# Altium schematic sheet 160901137.SchDoc
size A4
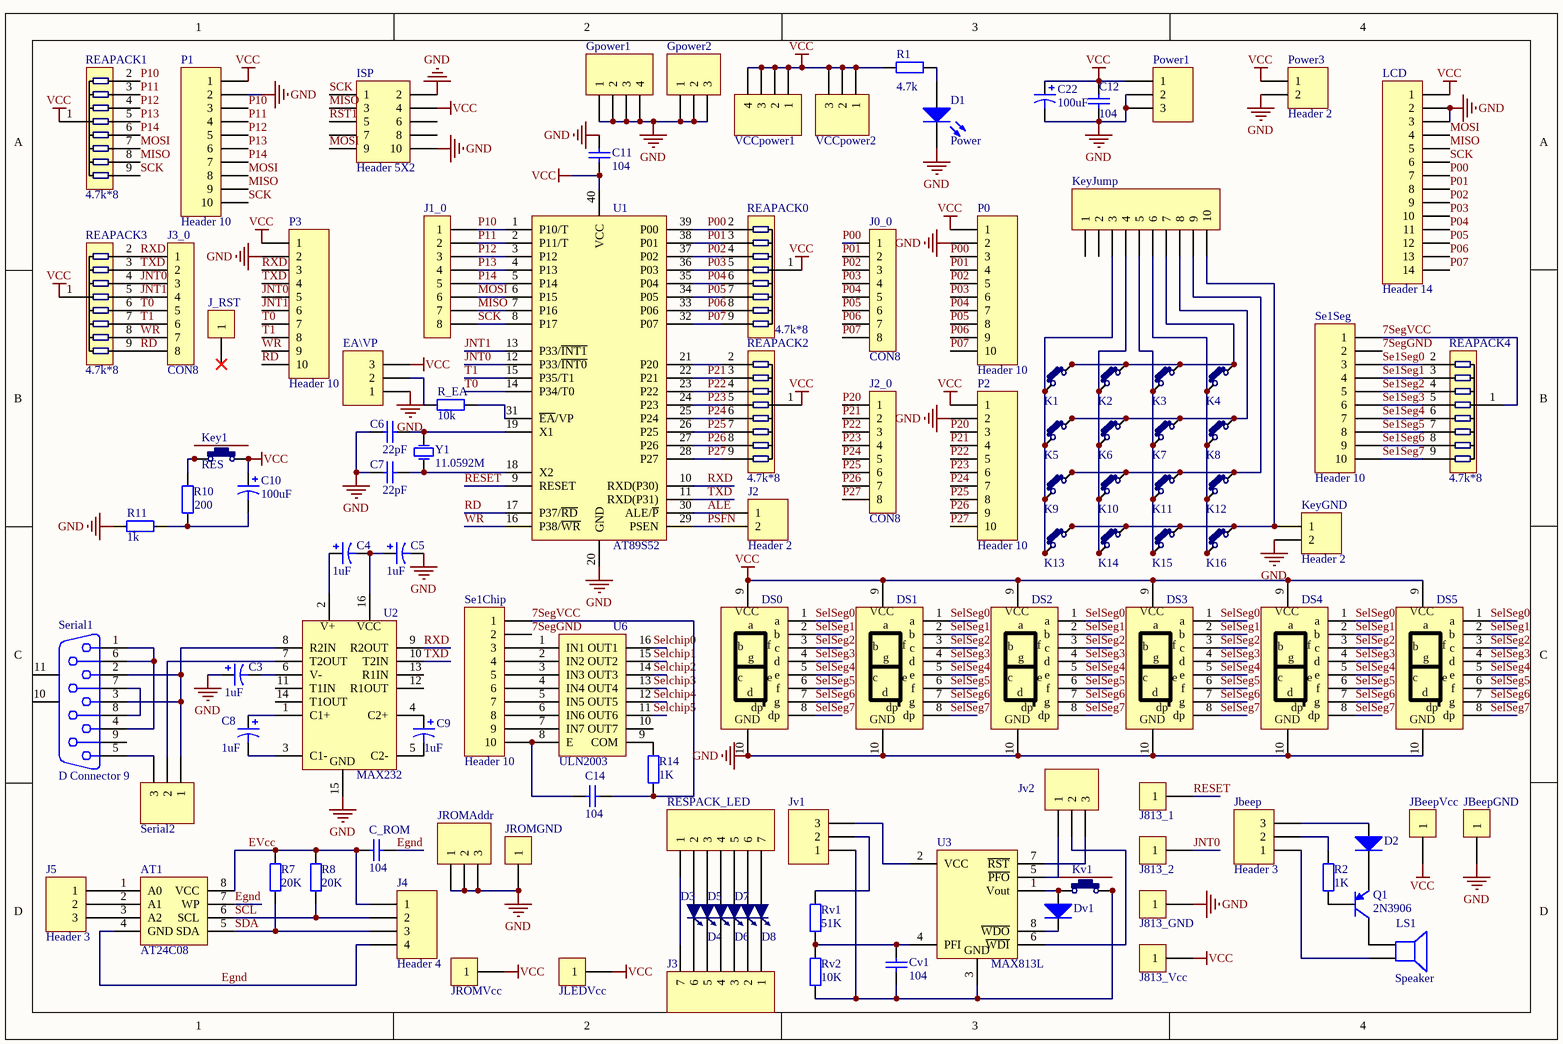
[diagram p0: 160901137.SchDoc]

## Parts
AT1  AT24C08  [DIP-8]
C3  value 1uF  [RB0.1-0.2]  (hidden comment: Cap Pol1)
C4  value 1uF  [RB0.1-0.2]  (hidden comment: Cap Pol1)
C5  value 1uF  [RB0.1-0.2]  (hidden comment: Cap Pol1)
C6  value 22pF  [RAD-0.1]  (hidden comment: Cap)
C7  value 22pF  [RAD-0.1]  (hidden comment: Cap)
C8  value 1uF  [RB0.1-0.2]  (hidden comment: Cap Pol1)
C9  value 1uF  [RB0.1-0.2]  (hidden comment: Cap Pol1)
C10  value 100uF  [RB0.1-0.2]  (hidden comment: Cap Pol1)
C11  value 104  [RAD-0.1]  (hidden comment: Cap)
C12  104  [RAD-0.1]
C14  104  [RAD-0.1]
C22  value 100uF  [RB0.1-0.2]  (hidden comment: Cap Pol1)
C_ROM  value 104  [RAD-0.1]  (hidden comment: Cap)
Cv1  104  [RAD-0.1]
D1  Power  [RB0.1-0.2]
D2  Diode 1N4148  [DO-35]  (value not drawn)
D3  LED-mini  [RB0.1-0.2]  (value not drawn)
D4  LED-mini  [RB0.1-0.2]  (value not drawn)
D5  LED-mini  [RB0.1-0.2]  (value not drawn)
D6  LED-mini  [RB0.1-0.2]  (value not drawn)
D7  LED-mini  [RB0.1-0.2]  (value not drawn)
D8  LED-mini  [RB0.1-0.2]  (value not drawn)
DS0  Display  [DISPLAY]  (value not drawn)
DS1  Display  [DISPLAY]  (value not drawn)
DS2  Display  [DISPLAY]  (value not drawn)
DS3  Display  [DISPLAY]  (value not drawn)
DS4  Display  [DISPLAY]  (value not drawn)
DS5  Display  [DISPLAY]  (value not drawn)
Dv1  Diode 1N4148  [DO-35]  (value not drawn)
EA\VP  Header 3  [HDR1X3]  (value not drawn)
Gpower1  Header 4  [HDR1X4]  (value not drawn)
Gpower2  Header 3  [HDR1X3]  (value not drawn)
ISP  Header 5X2  [HDR2X5]
J0_0  CON8  [HDR1X8]
J1_0  CON8  [HDR1X8]  (value not drawn)
J2  Header 2  [HDR1X2]
J2_0  CON8  [HDR1X8]
J3  Header 7  [HDR1X7]  (value not drawn)
J3_0  CON8  [HDR1X8]
J4  Header 4  [HDR1X4]
J5  Header 3  [HDR1X3]
J813_1  CON1  [PIN1]  (value not drawn)
J813_2  CON1  [PIN1]  (value not drawn)
J813_GND  CON1  [PIN1]  (value not drawn)
J813_Vcc  CON1  [PIN1]  (value not drawn)
J_RST  RST1  [PIN1]  (value not drawn)
Jbeep  Header 3  [HDR1X3]
JBeepGND  CON1  [PIN1]  (value not drawn)
JBeepVcc  CON1  [PIN1]  (value not drawn)
JLEDVcc  CON1  [PIN1]  (value not drawn)
JROMAddr  Header 3  [HDR1X3]  (value not drawn)
JROMGND  J_RST  [PIN1]  (value not drawn)
JROMVcc  CON1  [PIN1]  (value not drawn)
Jv1  Header 3  [HDR1X3]  (value not drawn)
Jv2  Header 3  [HDR1X3]  (value not drawn)
K1  KEY-S  [KEY]  (value not drawn)
K2  KEY-S  [KEY]  (value not drawn)
K3  KEY-S  [KEY]  (value not drawn)
K4  KEY-S  [KEY]  (value not drawn)
K5  KEY-S  [KEY]  (value not drawn)
K6  KEY-S  [KEY]  (value not drawn)
K7  KEY-S  [KEY]  (value not drawn)
K8  KEY-S  [KEY]  (value not drawn)
K9  KEY-S  [KEY]  (value not drawn)
K10  KEY-S  [KEY]  (value not drawn)
K11  KEY-S  [KEY]  (value not drawn)
K12  KEY-S  [KEY]  (value not drawn)
K13  KEY-S  [KEY]  (value not drawn)
K14  KEY-S  [KEY]  (value not drawn)
K15  KEY-S  [KEY]  (value not drawn)
K16  KEY-S  [KEY]  (value not drawn)
Key1  RES  [KEY]
KeyGND  Header 2  [HDR1X2]
KeyJump  Header 10  [HDR1X10]  (value not drawn)
Kv1  HEY-H  [KEY]  (value not drawn)
LCD  Header 14  [HDR1X14]
LS1  Speaker  [PIN2]
P0  Header 10  [HDR1X10]
P1  Header 10  [HDR1X10]
P2  Header 10  [HDR1X10]
P3  Header 10  [HDR1X10]
Power1  Header 3  [HDR1X3]  (value not drawn)
Power3  Header 2  [HDR1X2]
Q1  2N3906  [TO-92A]
R1  value 4.7k  [AXIAL-0.3]  (hidden comment: Res2)
R2  value 1K  [AXIAL-0.3]  (hidden comment: Res2)
R7  value 20K  [AXIAL-0.3]  (hidden comment: Res2)
R8  value 20K  [AXIAL-0.3]  (hidden comment: Res2)
R10  200  [AXIAL-0.3]
R11  value 1k  [AXIAL-0.3]  (hidden comment: Res2)
R14  value 1K  [AXIAL-0.3]  (hidden comment: Res2)
R_EA  value 10k  [AXIAL-0.3]  (hidden comment: Res2)
REAPACK0  4.7k*8  [HDR1X9]
REAPACK1  4.7k*8  [HDR1X9]
REAPACK2  4.7k*8  [HDR1X9]
REAPACK3  4.7k*8  [HDR1X9]
REAPACK4  4.7k*8  [HDR1X9]
RESPACK_LED  Header 7  [HDR1X7]  (value not drawn)
Rv1  value 51K  [AXIAL-0.3]  (hidden comment: Res2)
Rv2  value 10K  [AXIAL-0.3]  (hidden comment: Res2)
Se1Chip  Header 10  [HDR1X10]
Se1Seg  Header 10  [HDR1X10]
Serial1  D Connector 9  [DSUB1.385-2H9]
Serial2  Header 3  [HDR1X3]  (value not drawn)
U1  AT89S52  [DIP-40]
U2  MAX232  [DIP-16]
U3  MAX813L  [DIP-8]
U6  ULN2003  [DIP-16]
VCCpower1  Header 4  [HDR1X4]  (value not drawn)
VCCpower2  Header 3  [HDR1X3]  (value not drawn)
Y1  11.0592M  [R38]

## Nets
GND: C3.1 C5.2 C6.1 C7.1 C11.2 C12.2 C22.2 D1.2(K) DS0.10(GND) DS1.10(GND) DS2.10(GND) DS3.10(GND) DS4.10(GND) DS5.10(GND) EA\VP.1 Gpower1.1 Gpower1.2 Gpower1.3 Gpower1.4 Gpower2.1 Gpower2.2 Gpower2.3 ISP.2 ISP.10 J813_GND.1 JBeepGND.1 JROMAddr.1 JROMAddr.2 JROMAddr.3 JROMGND.1 KeyGND.2 LCD.2 LCD.3 P0.2 P1.2 P2.2 P3.2 Power1.2 Power1.3 Power3.2 R11.1 U1.20(GND) U2.15(GND)
VCC: C10.1 C11.1 C12.1 C22.1 DS0.9(VCC) DS1.9(VCC) DS2.9(VCC) DS3.9(VCC) DS4.9(VCC) DS5.9(VCC) EA\VP.3 ISP.4 J813_Vcc.1 JBeepVcc.1 JLEDVcc.1 JROMVcc.1 Key1.2 Key1.4 LCD.1 P0.1 P1.1 P2.1 P3.1 Power1.1 Power3.1 R1.1 REAPACK0.1 REAPACK1.1 REAPACK2.1 REAPACK3.1 U1.40(VCC) VCCpower1.1 VCCpower1.2 VCCpower1.3 VCCpower1.4 VCCpower2.1 VCCpower2.2 VCCpower2.3
7SegGND: Se1Chip.2 Se1Seg.2
7SegVCC: C14.1 R14.1 REAPACK4.1 Se1Chip.1 Se1Seg.1
ALE: J2.1 U1.30(ALE/~{P})
Egnd: AT1.4(GND) AT1.7(WP) C_ROM.2 J4.4
EVcc: AT1.8(VCC) C_ROM.1 J4.1 R7.2 R8.2
JNT0: J3_0.3 J813_2.1 P3.5 REAPACK3.4 U1.12(P33/~{INT0})
JNT1: J3_0.4 P3.6 REAPACK3.5 U1.13(P33/~{INT1})
MISO: ISP.3 J1_0.7 LCD.5 P1.9 REAPACK1.8 U1.7(P16)
MOSI: ISP.9 J1_0.6 LCD.4 P1.8 REAPACK1.7 U1.6(P15)
P00: J0_0.1 LCD.7 P0.3 REAPACK0.2 U1.39(P00)
P01: J0_0.2 LCD.8 P0.4 REAPACK0.3 U1.38(P01)
P02: J0_0.3 LCD.9 P0.5 REAPACK0.4 U1.37(P02)
P03: J0_0.4 LCD.10 P0.6 REAPACK0.5 U1.36(P03)
P04: J0_0.5 LCD.11 P0.7 REAPACK0.6 U1.35(P04)
P05: J0_0.6 LCD.12 P0.8 REAPACK0.7 U1.34(P05)
P06: J0_0.7 LCD.13 P0.9 REAPACK0.8 U1.33(P06)
P07: J0_0.8 LCD.14 P0.10 REAPACK0.9 U1.32(P07)
P10: J1_0.1 P1.3 REAPACK1.2 U1.1(P10/T)
P11: J1_0.2 P1.4 REAPACK1.3 U1.2(P11/T)
P12: J1_0.3 P1.5 REAPACK1.4 U1.3(P12)
P13: J1_0.4 P1.6 REAPACK1.5 U1.4(P13)
P14: J1_0.5 P1.7 REAPACK1.6 U1.5(P14)
P20: J2_0.1 P2.3
P21: J2_0.2 P2.4 REAPACK2.3 U1.22(P21)
P22: J2_0.3 P2.5 REAPACK2.4 U1.23(P22)
P23: J2_0.4 P2.6 REAPACK2.5 U1.24(P23)
P24: J2_0.5 P2.7 REAPACK2.6 U1.25(P24)
P25: J2_0.6 P2.8 REAPACK2.7 U1.26(P25)
P26: J2_0.7 P2.9 REAPACK2.8 U1.27(P26)
P27: J2_0.8 P2.10 REAPACK2.9 U1.28(P27)
PSFN: J2.2 U1.29(PSEN)
RD: J3_0.8 P3.10 REAPACK3.9 U1.17(P37/~{RD})
RESET: J813_1.1 U1.9(RESET)
RST1: ISP.5
RXD: J3_0.1 P3.3 REAPACK3.2 U1.10(RXD(P30)) U2.9(R2OUT)
SCK: ISP.1 J1_0.8 LCD.6 P1.10 REAPACK1.9 U1.8(P17)
SCL: AT1.6(SCL) J4.2 R8.1
SDA: AT1.5(SDA) J4.3 R7.1
Se1Seg0: REAPACK4.2 Se1Seg.3
Se1Seg1: REAPACK4.3 Se1Seg.4
Se1Seg2: REAPACK4.4 Se1Seg.5
Se1Seg3: REAPACK4.5 Se1Seg.6
Se1Seg4: REAPACK4.6 Se1Seg.7
Se1Seg5: REAPACK4.7 Se1Seg.8
Se1Seg6: REAPACK4.8 Se1Seg.9
Se1Seg7: REAPACK4.9 Se1Seg.10
Selchip0: U6.16(OUT1)
Selchip1: U6.15(OUT2)
Selchip2: U6.14(OUT3)
Selchip3: U6.13(OUT4)
Selchip4: U6.12(OUT5)
Selchip5: U6.11(OUT6)
SelSeg0: DS0.1(a) DS1.1(a) DS2.1(a) DS3.1(a) DS4.1(a) DS5.1(a)
SelSeg1: DS0.2(b) DS1.2(b) DS2.2(b) DS3.2(b) DS4.2(b) DS5.2(b)
SelSeg2: DS0.3(c) DS1.3(c) DS2.3(c) DS3.3(c) DS4.3(c) DS5.3(c)
SelSeg3: DS0.4(d) DS1.4(d) DS2.4(d) DS3.4(d) DS4.4(d) DS5.4(d)
SelSeg4: DS0.5(e) DS1.5(e) DS2.5(e) DS3.5(e) DS4.5(e) DS5.5(e)
SelSeg5: DS0.6(f) DS1.6(f) DS2.6(f) DS3.6(f) DS4.6(f) DS5.6(f)
SelSeg6: DS0.7(g) DS1.7(g) DS2.7(g) DS3.7(g) DS4.7(g) DS5.7(g)
SelSeg7: DS0.8(dp) DS1.8(dp) DS2.8(dp) DS3.8(dp) DS4.8(dp) DS5.8(dp)
T0: J3_0.5 P3.7 REAPACK3.6 U1.14(P34/T0)
T1: J3_0.6 P3.8 REAPACK3.7 U1.15(P35/T1)
TXD: J3_0.2 P3.4 REAPACK3.3 U1.11(RXD(P31)) U2.10(T2IN)
WR: J3_0.7 P3.9 REAPACK3.8 U1.16(P38/~{WR})
NetAT1_1: AT1.1(A0) J5.1
NetAT1_2: AT1.2(A1) J5.2
NetAT1_3: AT1.3(A2) J5.3
NetC3_2: C3.2 U2.6(V-)
NetC4_1: C4.1 U2.2(V+)
NetC4_2: C4.2 C5.1 U2.16(VCC)
NetC6_2: C6.2 U1.19(X1) Y1.2(OSC2)
NetC7_2: C7.2 U1.18(X2) Y1.1(OSC1)
NetC8_1: C8.1 U2.1(C1+)
NetC8_2: C8.2 U2.3(C1-)
NetC9_1: C9.1 U2.4(C2+)
NetC9_2: C9.2 U2.5(C2-)
NetC10_2: C10.2 R10.1 R11.2
NetC14_2: C14.2 Se1Chip.10 U6.8(E)
NetCv1_1: Cv1.1 Rv1.1 Rv2.2 U3.4(PFI)
NetCv1_2: Cv1.2 Jv1.1 Kv1.2 Kv1.4 Rv2.1 U3.3(GND)
NetD1_1: D1.1(A) R1.2
NetD2_1: D2.1(A) Jbeep.3
NetD2_2: D2.2(K) Q1.1(E)
NetD3_1: D3.1(A) RESPACK_LED.2
NetD3_2: D3.2(K) J3.6
NetD4_1: D4.1(A) RESPACK_LED.3
NetD4_2: D4.2(K) J3.5
NetD5_1: D5.1(A) RESPACK_LED.4
NetD5_2: D5.2(K) J3.4
NetD6_1: D6.1(A) RESPACK_LED.5
NetD6_2: D6.2(K) J3.3
NetD7_1: D7.1(A) RESPACK_LED.6
NetD7_2: D7.2(K) J3.2
NetD8_1: D8.1(A) RESPACK_LED.7
NetD8_2: D8.2(K) J3.1
NetDv1_1: Dv1.1(A) Kv1.1 Kv1.3 U3.1(Vout)
NetDv1_2: Dv1.2(K) U3.8(~{WDO})
NetE~{A}VP_2: EA\VP.2 R_EA.1
NetJ3_7: J3.7 RESPACK_LED.1
NetJbeep_1: Jbeep.1 LS1.2
NetJbeep_2: Jbeep.2 R2.2
NetJv1_2: Jv1.2 Rv1.2
NetJv1_3: Jv1.3 U3.2(VCC)
NetJv2_1: Jv2.1 U3.5(~{PFO})
NetJv2_2: Jv2.2 U3.6(~{WDI})
NetJv2_3: Jv2.3 U3.7(~{RST})
NetK1_1: K1.1 K1.3 K5.1 K5.3 K9.1 K9.3 K13.1 K13.3 KeyJump.3
NetK1_2: K1.2 K1.4 K2.2 K2.4 K3.2 K3.4 K4.2 K4.4 KeyJump.7
NetK2_1: K2.1 K2.3 K6.1 K6.3 K10.1 K10.3 K14.1 K14.3 KeyJump.4
NetK3_1: K3.1 K3.3 K7.1 K7.3 K11.1 K11.3 K15.1 K15.3 KeyJump.5
NetK4_1: K4.1 K4.3 K8.1 K8.3 K12.1 K12.3 K16.1 K16.3 KeyJump.6
NetK5_2: K5.2 K5.4 K6.2 K6.4 K7.2 K7.4 K8.2 K8.4 KeyJump.8
NetK9_2: K9.2 K9.4 K10.2 K10.4 K11.2 K11.4 K12.2 K12.4 KeyJump.9
NetK13_2: K13.2 K13.4 K14.2 K14.4 K15.2 K15.4 K16.2 K16.4 KeyGND.1 KeyJump.10
NetKey1_1: Key1.1 Key1.3 R10.2
NetLS1_1: LS1.1 Q1.3(C)
NetQ1_2: Q1.2(B) R2.1
NetR14_2: R14.2 U6.9(COM)
NetR_EA_2: R_EA.2 U1.31(~{EA}/VP)
NetREAPACK2_2: REAPACK2.2 U1.21(P20)
NetSe1Chip_3: Se1Chip.3 U6.1(IN1)
NetSe1Chip_4: Se1Chip.4 U6.2(IN2)
NetSe1Chip_5: Se1Chip.5 U6.3(IN3)
NetSe1Chip_6: Se1Chip.6 U6.4(IN4)
NetSe1Chip_7: Se1Chip.7 U6.5(IN5)
NetSe1Chip_8: Se1Chip.8 U6.6(IN6)
NetSe1Chip_9: Se1Chip.9 U6.7(IN7)
NetSerial1_1: Serial1.1 Serial1.4 Serial1.6
NetSerial1_2: Serial1.2 Serial1.3 Serial2.1 U2.8(R2IN)
NetSerial1_5: Serial1.5 Serial2.3
NetSerial1_7: Serial1.7 Serial1.8
NetSerial2_2: Serial2.2 U2.7(T2OUT)

Not connected (* = marked no-connect by the designer): ISP 6 7 8; J_RST 1*; KeyJump 1 2; Serial1 9 10(MH1) 11(MH2); U2 11(T1IN) 12(R1OUT) 13(R1IN) 14(T1OUT); U6 10(OUT7)

## Library data of the parts
C3-C5 C8-C10 C22 = Cap Pol1: Polarized Capacitor (Radial); Published: 8-Jun-2000; LatestRevisionDate: 17-Jul-2002; LatestRevisionNote: Re-released for DXP Platform.; PackageReference: RB7.6-15; Publisher: Altium Limited
C6 C7 C11 C_ROM = Cap: Capacitor; Published: 8-Jun-2000; LatestRevisionDate: 17-Jul-2002; LatestRevisionNote: Re-released for DXP Platform.; PackageReference: RAD-0.3; Publisher: Altium Limited; PackageDescription: Radial Cap, Thru-Hole; 2 Leads; 0.3 in Pin Spacing
C12 C14 Cv1 = Cap: Capacitor; Value: 22pF; Published: 8-Jun-2000; LatestRevisionDate: 17-Jul-2002; LatestRevisionNote: Re-released for DXP Platform.; PackageReference: RAD-0.3; Publisher: Altium Limited
D1 = LED0: Typical INFRARED GaAs LED; Published: 8-Jun-2000; LatestRevisionDate: 08-Jul-2005; LatestRevisionNote: Mech Layer 1 removed.; PackageReference: LED-0; Publisher: Altium Limited
D2 Dv1 = Diode 1N4148: High Conductance Fast Diode; Published: 8-Jun-2000; LatestRevisionDate: 17-Jul-2002; LatestRevisionNote: Re-released for DXP Platform.; DatasheetDocument: 1997; PackageReference: DO-35; Publisher: Altium Limited; Code_JEDEC: DO-204-AH; ComponentLink1Description: Manufacturer Link; ComponentLink1URL: http://www.fairchildsemi.com/; ComponentLink2Description: Datasheet; ComponentLink2URL: http://www.fairchildsemi.com/ds/1N%2F1N4148.pdf
EA\VP Gpower2 J5 Jbeep JROMAddr Jv1 Jv2 Power1 Serial2 VCCpower2 = Header 3: Header, 3-Pin; LatestRevisionDate: 17-Jul-2002; LatestRevisionNote: Re-released for DXP Platform.; Publisher: Altium Limited
Gpower1 J4 VCCpower1 = Header 4: Header, 4-Pin; LatestRevisionDate: 17-Jul-2002; LatestRevisionNote: Re-released for DXP Platform.; Publisher: Altium Limited
ISP = Header 5X2: Header, 5-Pin, Dual row; LatestRevisionDate: 17-Jul-2002; LatestRevisionNote: Re-released for DXP Platform.; Publisher: Altium Limited
J2 KeyGND Power3 = Header 2: Header, 2-Pin; LatestRevisionDate: 17-Jul-2002; LatestRevisionNote: Re-released for DXP Platform.; Publisher: Altium Limited
J3 RESPACK_LED = Header 7: Header, 7-Pin; LatestRevisionDate: 17-Jul-2002; LatestRevisionNote: Re-released for DXP Platform.; Publisher: Altium Limited
J_RST JROMGND = CON1
Key1 = KEY-H
KeyJump P0-P3 Se1Chip Se1Seg = Header 10: Header, 10-Pin; LatestRevisionDate: 17-Jul-2002; LatestRevisionNote: Re-released for DXP Platform.; Publisher: Altium Limited
LCD = Header 14: Header, 14-Pin; LatestRevisionDate: 17-Jul-2002; LatestRevisionNote: Re-released for DXP Platform.; Publisher: Altium Limited
LS1 = Speaker: Loudspeaker; Published: 24-Mar-1999; LatestRevisionDate: 17-Jul-2002; LatestRevisionNote: Re-released for DXP Platform.; PackageReference: PIN2; Publisher: Altium Limited
Q1 = 2N3906: PNP General Purpose Amplifier; Published: 8-Jun-2000; LatestRevisionDate: 15-Jan-2003; LatestRevisionNote: PCB Footprint 'BCY-W3/D4.7' replaced; DatasheetDocument: 1997; PackageDocument: Sep-1998; PackageReference: TO-92A; Publisher: Altium Limited; Code_JEDEC: TO-92A; ComponentLink1Description: Manufacturer Link; ComponentLink1URL: http://www.fairchildsemi.com/; ComponentLink2Description: Datasheet; ComponentLink2URL: http://www.fairchildsemi.com/ds/2N%2F2N3906.pdf
R1 R2 R7 R8 R10 R11 R14 R_EA Rv1 Rv2 = Res2: Resistor; Published: 8-Jun-2000; LatestRevisionDate: 17-Jul-2002; LatestRevisionNote: Re-released for DXP Platform.; PackageReference: AXIAL-0.4; Publisher: Altium Limited
  R7 R8: PackageDescription: Axial Device, Thru-Hole; 2 Leads; 0.4 in Pin Spacing
  R10: Value: 200
REAPACK0-REAPACK4 = Respack8-9
Serial1 = D Connector 9: Receptacle Assembly, 9 Position, Right Angle; PackageDocument: O; Positions: 9; Published: 15-Jun-2001; LatestRevisionDate: 17-Jul-2002; LatestRevisionNote: Re-released for DXP Platform.; DatasheetDocument: 1-Sep-1999; PackageReference: 788750; Publisher: Altium Limited; Orientation: Right Angle; Gender: Receptacle
Y1 = XTAL: Crystal Oscillator; Published: 8-Jun-2000; LatestRevisionDate: 17-Jul-2002; LatestRevisionNote: Re-released for DXP Platform.; PackageReference: R38; Publisher: Altium Limited; PackageDescription: Crystal, Thru-Hole; 2 Leads; Body 3.1 x 8.2 mm (Dia.xH)